# Altium schematic sheet ePaper_Display_Top.SchDoc
size A4; SheetNumber: 1; SheetTotal: 7
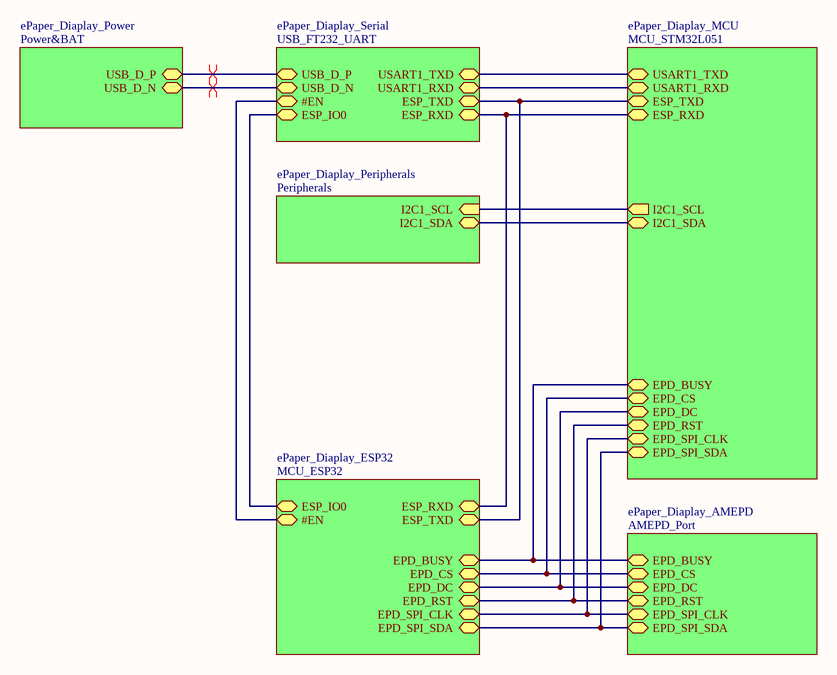
[diagram p0: ePaper_Display_Top.SchDoc]

## Sub-sheets
ePaper_Diaplay_AMEPD = AMEPD_Port: EPD_BUSY (bidir), EPD_CS (bidir), EPD_DC (bidir), EPD_RST (bidir), EPD_SPI_CLK (bidir), EPD_SPI_SDA (bidir)
ePaper_Diaplay_ESP32 = MCU_ESP32: #EN (bidir), ESP_IO0 (bidir), ESP_RXD (bidir), ESP_TXD (bidir), EPD_SPI_SDA (bidir), EPD_SPI_CLK (bidir), EPD_RST (bidir), EPD_DC (bidir), EPD_CS (bidir), EPD_BUSY (bidir)
ePaper_Diaplay_MCU = MCU_STM32L051: I2C1_SCL (out), I2C1_SDA (bidir), USART1_TXD (bidir), USART1_RXD (bidir), ESP_TXD (bidir), ESP_RXD (bidir), EPD_DC (bidir), EPD_BUSY (bidir), EPD_CS (bidir), EPD_RST (bidir), EPD_SPI_CLK (bidir), EPD_SPI_SDA (bidir)
ePaper_Diaplay_Peripherals = Peripherals: I2C1_SDA (bidir), I2C1_SCL (in)
ePaper_Diaplay_Power = Power&BAT: USB_D_P (bidir), USB_D_N (bidir)
ePaper_Diaplay_Serial = USB_FT232_UART: USB_D_N (bidir), USB_D_P (bidir), USART1_RXD (bidir), USART1_TXD (bidir), #EN (bidir), ESP_IO0 (bidir), ESP_TXD (bidir), ESP_RXD (bidir)

## Nets
(unnamed): sheet ePaper_Diaplay_Power/USB_D_P, sheet ePaper_Diaplay_Serial/USB_D_P
(unnamed): sheet ePaper_Diaplay_Power/USB_D_N, sheet ePaper_Diaplay_Serial/USB_D_N
(unnamed): sheet ePaper_Diaplay_MCU/I2C1_SCL, sheet ePaper_Diaplay_Peripherals/I2C1_SCL
(unnamed): sheet ePaper_Diaplay_MCU/I2C1_SDA, sheet ePaper_Diaplay_Peripherals/I2C1_SDA
(unnamed): sheet ePaper_Diaplay_MCU/USART1_TXD, sheet ePaper_Diaplay_Serial/USART1_TXD
(unnamed): sheet ePaper_Diaplay_MCU/USART1_RXD, sheet ePaper_Diaplay_Serial/USART1_RXD
(unnamed): sheet ePaper_Diaplay_MCU/ESP_TXD, sheet ePaper_Diaplay_Serial/ESP_TXD, sheet ePaper_Diaplay_ESP32/ESP_TXD
(unnamed): sheet ePaper_Diaplay_MCU/ESP_RXD, sheet ePaper_Diaplay_Serial/ESP_RXD, sheet ePaper_Diaplay_ESP32/ESP_RXD
(unnamed): sheet ePaper_Diaplay_MCU/EPD_DC, sheet ePaper_Diaplay_ESP32/EPD_DC, sheet ePaper_Diaplay_AMEPD/EPD_DC
(unnamed): sheet ePaper_Diaplay_MCU/EPD_BUSY, sheet ePaper_Diaplay_ESP32/EPD_BUSY, sheet ePaper_Diaplay_AMEPD/EPD_BUSY
(unnamed): sheet ePaper_Diaplay_MCU/EPD_CS, sheet ePaper_Diaplay_ESP32/EPD_CS, sheet ePaper_Diaplay_AMEPD/EPD_CS
(unnamed): sheet ePaper_Diaplay_MCU/EPD_RST, sheet ePaper_Diaplay_ESP32/EPD_RST, sheet ePaper_Diaplay_AMEPD/EPD_RST
(unnamed): sheet ePaper_Diaplay_MCU/EPD_SPI_CLK, sheet ePaper_Diaplay_ESP32/EPD_SPI_CLK, sheet ePaper_Diaplay_AMEPD/EPD_SPI_CLK
(unnamed): sheet ePaper_Diaplay_MCU/EPD_SPI_SDA, sheet ePaper_Diaplay_ESP32/EPD_SPI_SDA, sheet ePaper_Diaplay_AMEPD/EPD_SPI_SDA
(unnamed): sheet ePaper_Diaplay_Serial/#EN, sheet ePaper_Diaplay_ESP32/#EN
(unnamed): sheet ePaper_Diaplay_Serial/ESP_IO0, sheet ePaper_Diaplay_ESP32/ESP_IO0

## Layout directives
differential pair: (no net found under the mark)

## Notes on the sheet
- Date:
- Size:
- Project Title:
- A4
- Revision:
- Sheet:
- of:
- File:
- Author:
- Chenhui Zhao